# Altium schematic sheet DIOT_PSU_integrated.SchDoc: DI/OT Crate
size 420 x 297 mm; Project: DI/OT Backplane - Front panel PCB; CheckedBy: G. Daniluk; Author: F. Świtakowski; CompanyName: Creotech Instruments SA; DrawnBy: F. Świtakowski; Organization: CERN; Address1: European Organization for Nuclear Research; Address2: CH-1211 Geneve 23 - Switzerland; DocumentNumber: 1; Revision: -; SheetNumber: 1; SheetTotal: 1; EDA_Number: EDA-04213-V3-0; Projet: DI/OT Crate; CreateDate: 1.10.2019; CheckedDate: 10.11.2019; Title2: Front Interface; DivGrp: BE-CEM; Designer: F. Świtakowski; SPICEModelCacheTQWPXFHW: <root> / <DocumentId>TQWPXFHW</DocumentId> / </root>; DocumentName: AFPGA_power.SchDoc; ModifiedDate: -; Rule: PcbType=ProtelPcb
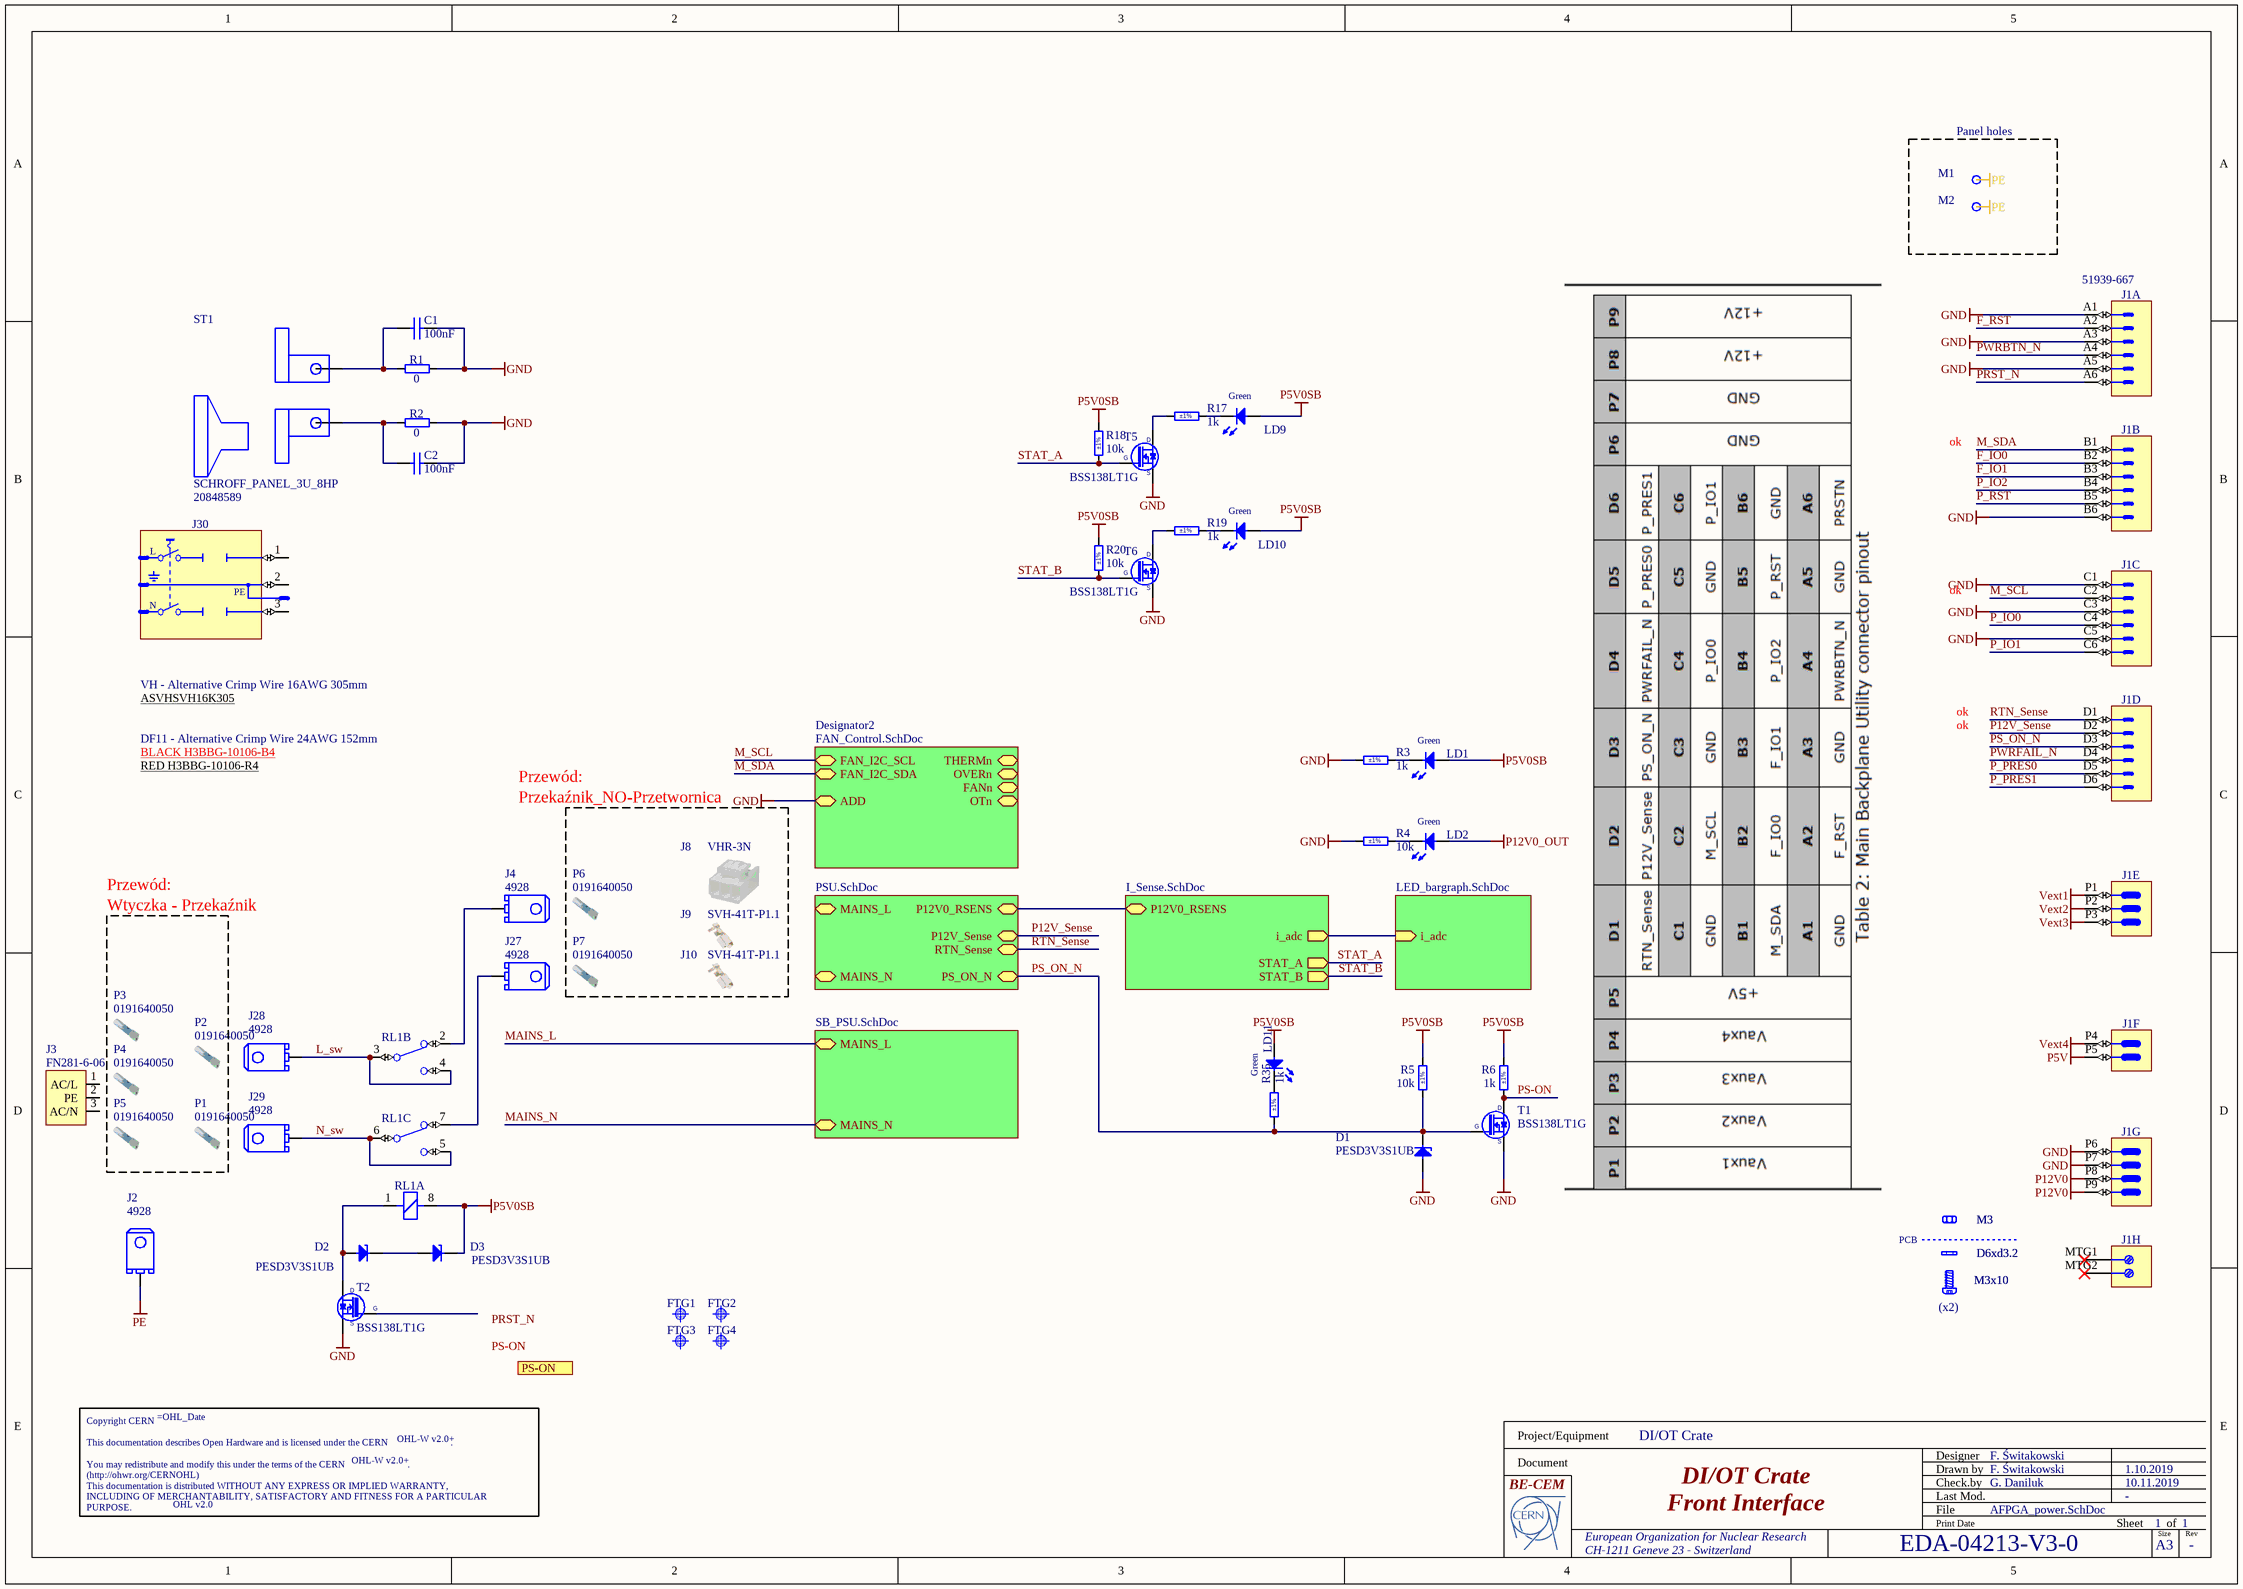
[diagram p0: DIOT_PSU_integrated.SchDoc]

## Parts
C1  100nF  [CAPC1608X87N]
C2  100nF  [CAPC1608X87N]
D1  PESD3V3S1UB  [SODFL1608X65N]
D2  PESD3V3S1UB  [SODFL1608X65N]
D3  PESD3V3S1UB  [SODFL1608X65N]
FTG1  Use only in PCB  [FIDUCIAL_TOP_C100-200]  (value not drawn)
FTG2  Use only in PCB  [FIDUCIAL_TOP_S100-200]  (value not drawn)
FTG3  Use only in PCB  [FIDUCIAL_TOP_C100-200]  (value not drawn)
FTG4  Use only in PCB  [FIDUCIAL_TOP_S100-200]  (value not drawn)
J1  Manufacturer Part Number: 51939-667  [AMPHENOL_51939-667]  (hidden comment: PwrBlade)  (parts A,B,C,D,E,F,G,H of 8)
J2  4928  [KEYSTONE_4928]
J3  FN281-6-06  [FN9264-2-06]
J4  4928  [KEYSTONE_4928]
J8  VHR-3N  [VHR-3N]
J9  SVH-41T-P1.1  [SVH-41T-P1.1]
J10  SVH-41T-P1.1  [SVH-41T-P1.1]
J27  4928  [KEYSTONE_4928]
J28  4928  [KEYSTONE_4928]
J29  4928  [KEYSTONE_4928]
J30  IEC  [SCHURTER_DD21.0121.1111]  (value not drawn)
LD1  Green  [LED_AVAGO_HSME-C120]
LD2  Green  [LED_AVAGO_HSME-C120]
LD9  Green  [LED_AVAGO_HSME-C120]
LD10  Green  [LED_AVAGO_HSME-C120]
LD11  Green  [LED_AVAGO_HSME-C120]
M1  Plated Hole  [MTG300_600]  (value not drawn)  (no BOM)
M2  Plated Hole  [MTG300_600]  (value not drawn)  (no BOM)
NUT1  M3  [BOSSARD_BN628-1241443_v]
NUT2  M3  [BOSSARD_BN628-1241443_v]
OHL1  CERN_OHL  [CERN_OHL]  (value not drawn)  (no BOM)
P1  0191640050  [0191640050]
P2  0191640050  [0191640050]
P3  0191640050  [0191640050]
P4  0191640050  [0191640050]
P5  0191640050  [0191640050]
P6  0191640050  [0191640050]
P7  0191640050  [0191640050]
R1  0  [RESC1608X55N]
R2  0  [RESC1608X55N]
R3  1k  Tolerance: ±1%  [RESC1608X55N]
R4  10k  Tolerance: ±1%  [RESC1608X55N]
R5  10k  Tolerance: ±1%  [RESC1608X55N]
R6  1k  Tolerance: ±1%  [RESC1608X55N]
R17  1k  Tolerance: ±1%  [RESC1608X55N]
R18  10k  Tolerance: ±1%  [RESC1608X55N]
R19  1k  Tolerance: ±1%  [RESC1608X55N]
R20  10k  Tolerance: ±1%  [RESC1608X55N]
R35  1k  Tolerance: ±1%  [RESC1608X55N]
RL1  REL_OMRON_G2RL-24  [REL_OMRON_G2RL-24]  (value not drawn)  (parts A,B,C of 3)
SCREW1  M3x10  [BOSSARD_BN5687-3061608_v]
SCREW2  M3x10  [BOSSARD_BN5687-3061608_v]
ST1  SCHROFF_PANEL_3U_8HP  Manufacturer Part Number 2: 20848589  [SCHROFF_PANEL_3HP_8U_CPCIS_AC_PSU]
T1  BSS138LT1G  [SOT95P240X110-3N]
T2  BSS138LT1G  [SOT95P240X110-3N]
T5  BSS138LT1G  [SOT95P240X110-3N]
T6  BSS138LT1G  [SOT95P240X110-3N]
WASHER1  D6xd3.2  [BOSSARD_BN83728-8243964_v]
WASHER2  D6xd3.2  [BOSSARD_BN83728-8243964_v]

## Blocks framed on the sheet
Panel holes: M1 M2
Wtyczka - Przekaźnik: P1-P5

## Sub-sheets
Designator1 = LED_bargraph.SchDoc: i_adc (in)
Designator2 = FAN_Control.SchDoc: ADD (bidir), THERMn (bidir), OVERn (bidir), FANn (bidir), FAN_I2C_SCL (bidir), FAN_I2C_SDA (bidir), OTn (bidir)
Designator3 = I_Sense.SchDoc: i_adc (out), STAT_A (out), STAT_B (out), P12V0_RSENS (bidir)
Designator4 = PSU.SchDoc: P12V_Sense (bidir), RTN_Sense (bidir), PS_ON_N (bidir), MAINS_L (bidir), MAINS_N (bidir), P12V0_RSENS (bidir)
Designator5 = SB_PSU.SchDoc: MAINS_L (bidir), MAINS_N (bidir)

## Ports
PS-ON (in)

## Nets
GND: C1.1 C2.1 D1.2(A) J1.A1 J1.A3 J1.A5 J1.B6 J1.C1 J1.C3 J1.C5 J1.P6 J1.P7 R1.2 R2.2 R3.1 R4.1 T1.2(S) T2.2(S) T5.2(S) T6.2(S) ; sheet Designator2/ADD
P5V: J1.P5
P5V0SB: D3.1(C) LD1.2(A) LD9.2(A) LD10.2(A) LD11.2(A) R5.2 R6.2 R18.2 R20.2 RL1.8
P12V0: J1.P8 J1.P9
P12V0_OUT: LD2.2(A)
PE: J2.1 M1.1 M2.1
Vext1: J1.P1
Vext2: J1.P2
Vext3: J1.P3
Vext4: J1.P4
F_IO0: J1.B2
F_IO1: J1.B3
F_RST: J1.A2
L_sw: J28.1 RL1.3(C) RL1.4(NO)
M_SCL: J1.C2 ; sheet Designator2/FAN_I2C_SCL
M_SDA: J1.B1 ; sheet Designator2/FAN_I2C_SDA
MAINS_L: sheet Designator5/MAINS_L
MAINS_N: sheet Designator5/MAINS_N
N_sw: J29.1 RL1.5(NO) RL1.6(C)
P12V_Sense: J1.D2 ; sheet Designator4/P12V_Sense
P_IO0: J1.C4
P_IO1: J1.C6
P_IO2: J1.B4
P_PRES0: J1.D5
P_PRES1: J1.D6
P_RST: J1.B5
PRST_N: J1.A6
PS-ON: R6.1 T1.3(D)
PS_ON_N: D1.1(C) J1.D3 R5.1 R35.1 T1.1(G) ; sheet Designator4/PS_ON_N
PWRBTN_N: J1.A4
PWRFAIL_N: J1.D4
RTN_Sense: J1.D1 ; sheet Designator4/RTN_Sense
STAT_A: R18.1 T5.1(G) ; sheet Designator3/STAT_A
STAT_B: R20.1 T6.1(G) ; sheet Designator3/STAT_B
NetC1_2: C1.2 R1.1 ST1.MH1
NetC2_2: C2.2 R2.1 ST1.MH2
NetD2_1: D2.1(C) D3.2(A)
NetD2_2: D2.2(A) RL1.1 T2.3(D)
NetJ4_1: J4.1 RL1.2(NC)
NetJ27_1: J27.1 RL1.7(NC)
NetLD1_1: LD1.1(C) R3.2
NetLD2_1: LD2.1(C) R4.2
NetLD9_1: LD9.1(C) R17.2
NetLD10_1: LD10.1(C) R19.2
NetLD11_1: LD11.1(C) R35.2
NetR17_1: R17.1 T5.3(D)
NetR19_1: R19.1 T6.3(D)
(unnamed): sheet Designator1/i_adc, sheet Designator3/i_adc
(unnamed): sheet Designator3/P12V0_RSENS, sheet Designator4/P12V0_RSENS

Not connected (* = marked no-connect by the designer): J1 MTG1* MTG2*; J3 1(AC/L) 2(PE) 3(AC/N); J30 1 2 3; T2 1(G)

## Notes on the sheet
- ok
- ASVHSVH16K305 <https://www.digikey.pl/en/products/detail/jst-sales-america-inc/ASVHSVH16K305/6009483>
- VH - Alternative Crimp Wire 16AWG 305mm
- DF11 - Alternative Crimp Wire 24AWG 152mm
- BLACK H3BBG-10106-B4 <https://www.digikey.pl/en/products/detail/jst-sales-america-inc/ASVHSVH16K203/9924197>
- RED H3BBG-10106-R4 <https://www.digikey.pl/en/products/detail/hirose-electric-co-ltd/H3BBG-10106-R4/312538?s=N4IgTCBcDaIBIGYBCSDiBaAjABhwNnQCUAWEAXQF8g>
- Przewód:
- (near J8) Przekaźnik_NO-Przetwornica
- PCB
- (x2)
- Labels drawn without touching a wire or pin: PRST_N, PS-ON
- Project/Equipment
- Document
- Designer
- Drawn by
- Check.by
- File
- Last Mod.
- Print Date
- Sheet
- Size
- A3
- of
- Rev
- (in symbol CERN_OHL) Copyright CERN / This documentation describes Open Hardware and is licensed under the CERN                         . / You may redistribute and modify this under the terms of the CERN                         . / (http://ohwr.org/CERNOHL) / This documentation is distributed WITHOUT ANY EXPRESS OR IMPLIED WARRANTY, / INCLUDING OF MERCHANTABILITY, SATISFACTORY AND FITNESS FOR A PARTICULAR PURPOSE. / Please see the CERN                   for applicable conditions.
- (in symbol SCHURTER_DD21.0121.1111) L; PE; N

## Library data of the parts
C1 C2 = CC0603_100NF_50V_10%_X5R: Non-polarised capacitor; Part Description: SMD Multilayer Chip Ceramic Capacitor; Manufacturer: GENERIC; Manufacturer1 Part Number: C1608X5R1H104K080; Voltage: 50V; TC: X5R; Tolerance: ±10%; Part Number: CC0603_100NF_50V_10%_X5R; Component Kind: Standard; Component Type: Standard; Pin Count: 2; Value: 100nF; Status: None; Manufacturer Part Number: CC0603_100NF_50V_10%_X5R; Case: 0603; Mounted: Yes; Socket: No; SMD: Yes; Sense: No; Manufacturer1 Example: TDK; Manufacturer1 ComponentHeight: 0.9mm; HelpURL: \\cern.ch\dfs\Applications\Altium\Datasheets\CC0603_X5R_TDK_C.pdf; Author: CERN DEM MR; CreateDate: 08.01.2016; LatestRevisionDate: 08.01.2016
D1-D3 = PESD3V3S1UB: ESD protection diode; Part Description: ESD protection diode (23kV); Manufacturer: NXP SEMICONDUCTORS; Voltage: 3V3; Power: 330W; PressFit: No; Bonding: No; Part Number: PESD3V3S1UB; Component Kind: Standard; Component Type: Standard; Device: PESD3V3S1UB; PackageDescription: Ultra Small Outline Diode Flat Lead (SOD-523), Body; 1.2mm L X 0.8mm W X 0.65mm H, IPC Medium Density; Manufacturer Part Number: PESD3V3S1UB; Pin Count: 2; Case: SOD523; Mounted: Yes; Socket: No; SMD: Yes; Sense: No; ComponentHeight: 0.65mm; HelpURL: \\cern.ch\dfs\Applications\Altium\Datasheets\PESD3V3S1UB.pdf; Author: CERN DEM JLC; CreateDate: 29.11.2012; LatestRevisionDate: 29.11.2012
FTG1 FTG3 = FIDUCIAL_TARGET_C100-200: Fiducial Target; Part Description: Round Fiducial Target, Top Layer, 1.0mm, Top Solder 2.0mm, Keepout =2.0mm; Mounted: No; Part Number: FIDUCIAL_TARGET_C100-200; Component Kind: Standard (No BOM); Component Type: Standard (No BOM); Pin Count: 1; Family: Fiducial; Socket: No; SMD: Yes; Sense: No; Status: None; ComponentHeight: 0mm; HelpURL: Undefined; Author: CERN DEM JLC; CreateDate: 09.02.2010; LatestRevisionDate: 04.04.2012; PackageDescription: Round Fiducial Target, Top Layer, 1.0mm, Top Solder 2.0mm, Keepout =2.0mm
FTG2 FTG4 = FIDUCIAL_TARGET_S100-200: Fiducial Target; Part Description: Square Fiducial Target, Top Layer, 1.0mm, Top Solder 2.0mm, Keepout =2.0mm; Mounted: No; Part Number: FIDUCIAL_TARGET_S100-200; Component Kind: Standard (No BOM); Component Type: Standard (No BOM); Pin Count: 1; Family: Fiducial; Socket: No; SMD: Yes; Sense: No; Status: None; ComponentHeight: 0mm; HelpURL: Undefined; Author: CERN DEM JLC; CreateDate: 09.02.2010; LatestRevisionDate: 04.04.2012; PackageDescription: Square Fiducial Target, Top Layer, 1.0mm, Top Solder 2.0mm, Keepout =2.0mm
J1 = AMPHENOL_51939-667: Thru-Hole, Lead 3.43mm, PowerBlade Right Angled Power Connector 3ACP 2P 24S 4P Contacts; Part Description: Right Angle PowerBlade Power Connector 3ACP + 2P + 24S + 4P Contacts; PressFit: No; Part Number: AMPHENOL_51939-667; Component Kind: Standard; Component Type: Standard; Pin Count: 33; Family: PwrBlade; Mounted: Yes; Socket: No; SMD: No; Sense: No; Status: None; Manufacturer: AMPHENOL; ComponentHeight: 12.57mm; HelpURL: \\cern.ch\dfs\Applications\Altium\Datasheets\AMPHENOL_51939-667.pdf; Author: CERN DEM JLC; CreateDate: 05.03.2019; LatestRevisionDate: 05.03.2019
J2 J4 J27-J29 = KEYSTONE_4928: 0.240" (6.10mm) Quick Connect Male Solder Connector Non-Insulated; PressFit: No; Part Number: 4928; Component Kind: Standard; Component Type: Standard; Pin Count: 4; Mounted: Yes; Socket: No; SMD: No; Sense: No; Status: None; Part Description: 0.240" (6.10mm) Quick Connect Male Solder Connector Non-Insulated; Manufacturer: KEYSTONE; Manufacturer Part Number: 4928; ComponentHeight: 10.49mm; HelpURL: https://www.keyelco.com/product-pdf.cfm?p=14309; Author: LPA; CreateDate: 18.02.2025; LatestRevisionDate: 18.02.2025; ComponentLink1Description: Datasheet; ComponentLink1URL: https://www.keyelco.com/product-pdf.cfm?p=14309
J3 = FN281-6-06: Power Entry Connector Receptacle, Male Blades - Module IEC 320-C14 Panel Mount, Flange; Manufacturer: Schaffner EMC Inc.; PressFit: No; Part Number: FN281-6-06; Footprint: FN281-6-06; Pin Count: 3; Mounted: Yes; Socket: No; SMD: No; Sense: No; Status: None; Part Description: Power Entry Connector Receptacle, Male Blades - Module IEC 320-C14 Panel Mount, Flange; Manufacturer Part Number: FN281-6-06; ComponentHeight: 35; HelpURL: https://www.schaffner.com/product/FN280/Schaffner_datasheet_FN280.pdf; Author: LPA; CreateDate: 08.02.2025; LatestRevisionDate: 08.02.2025; ComponentLink1Description: Datasheet; ComponentLink1URL: https://www.digikey.pl/pl/products/detail/schaffner-emc-inc/FN281-6-06/1997105?srsltid=AfmBOopo_2hCIzMtiGmdja5qUgne8hiecT0bkO3ZLGT1zD_KD1Bja1J0
J8 = VHR-3N: 3 Rectangular Connectors - Housings Receptacle Natural 0.156" (3.96mm); Manufacturer: JST Sales America Inc.; PressFit: No; Part Number: VHR-3N; Component Kind: Standard; Component Type: Standard; Pin Count: 1; Family: VH; Mounted: Yes; Socket: No; SMD: No; Sense: No; Status: None; Part Description: 3 Rectangular Connectors - Housings Receptacle Natural 0.156" (3.96mm); Manufacturer Part Number: VHR-3N; HelpURL: https://www.jst-mfg.com/product/pdf/eng/eVH.pdf; Author: LPA; CreateDate: 09.02.2025; LatestRevisionDate: 09.02.2025
J9 J10 = SVH-41T-P1.1: Socket Contact Tin 16-20 AWG Crimp; Manufacturer: JST Sales America Inc.; PressFit: No; Part Number: SVH-41T-P1.1; Component Kind: Socket Contact; Component Type: Socket Contact; Pin Count: 1; Family: vh; Mounted: Yes; Socket: No; SMD: No; Sense: No; Status: None; Part Description: Socket Contact Tin 16-20 AWG Crimp; Manufacturer Part Number: SVH-41T-P1.1; ComponentHeight: N/A; HelpURL: https://www.jst-mfg.com/product/pdf/eng/eVH.pdf; Author: LPA; CreateDate: 09.02.2025; LatestRevisionDate: 09.02.2025
J30 = SCHURTER_DD21.0121.1111: Connector 3 Male 2P+ 2 Fuse Holder + Line Switch 2 Poles; Part Description: 10A 250Vac IEC Appliance Inlet C14 with Line Switch 2-Pole, Fuseholder 2-Pole for Fuse Links 5x20mm; PressFit: No; Part Number: SCHURTER_DD21.0121.1111; Component Kind: Standard; Component Type: Standard; Pin Count: 3; Family: IEC; Mounted: Yes; Socket: No; SMD: No; Sense: No; Status: None; Manufacturer: SCHURTER; Manufacturer Part Number: DD21.0121.1111; ComponentHeight: 32.3mm; HelpURL: \\cern.ch\dfs\Applications\Altium\Datasheets\SCHURTER_DD21.0121.1111.pdf; Author: CERN DEM JLC; CreateDate: 19.11.2012; LatestRevisionDate: 19.11.2012
LD1 LD2 LD9-LD11 = LED_AVAGO_HSME-C120: LED Green 1C 2A; Part Description: High Performance Right Angle Chip Green LED; Manufacturer: AVAGO TECHNOLOGIES; PressFit: No; Bonding: No; Part Number: LED_AVAGO_HSME-C120; Component Kind: Standard; Component Type: Standard; Color: Green; PackageDescription: Green Chip LED, 2-Leads, Body 1.7x1.1mm, Side Emitting Package; Manufacturer Part Number: HSME-C120; Pin Count: 2; Mounted: Yes; Socket: No; SMD: Yes; Sense: No; ComponentHeight: 0.7mm; HelpURL: \\cern.ch\dfs\Applications\Altium\Datasheets\LED_AVAGO_HSME-C120.pdf; ComponentLink1URL: \\cern.ch\dfs\Applications\Altium\Datasheets\LED_AVAGO_HSME-C110_DESIGN-GUIDE.pdf; ComponentLink1Description: Design Guide; Author: CERN DEM JMW; CreateDate: 22.07.2009; LatestRevisionDate: 20.06.2012
M1 M2 = PLATED_HOLE3.0_PAD6.0: Single Terminal Socket; Part Description: Plated Through Hole: Hole Dia.=3.0mm Pad Dia.=6.0mm; Mounted: No; Part Number: PLATED_HOLE3.0_PAD6.0; Component Type: Standard (No BOM); Pin Count: 1; Family: Plated Hole; Socket: No; SMD: No; Status: None; ComponentHeight: 0mm; Author: CERN DEM JLC; CreateDate: 26.05.2008; LatestRevisionDate: 26.05.2008; PackageDescription: Plated Through Hole: Hole Dia.=3.0mm Pad Dia.=6.0mm; Sense: No; HelpURL: Undefined
NUT1 NUT2 = BOSSARD_BN628-1241443_v: Nut; Part Description: M3 Hexagon Nut ~0,8d, ISO 4032, DIN 934, Stainless Steel A2; Manufacturer Part Number: BN628 Art.1241443; PressFit: No; Part Number: BOSSARD_BN628-1241443_v; Component Kind: Standard; Component Type: Mechanical; Pin Count: 0; PackageDescription: M3 Hexagon Nut ~0,8d, ISO 4032, DIN 934, Stainless Steel A2; Mounted: Yes; Socket: No; SMD: No; Sense: No; Status: None; Value: M3; Manufacturer: BOSSARD; ComponentHeight: 2.4mm; HelpURL: \\cern.ch\dfs\Applications\Altium\Datasheets\BOSSARD_BN628-1241443.pdf; Author: CERN DEM JMW; CreateDate: 04.12.2015; LatestRevisionDate: 04.12.2015
OHL1 = CERN_OHL: Part Description: Copyright CERN; OHL_License: OHL-W v2.0+; OHL_Version: OHL v2.0; Mounted: No; OHL_Date: =Year; Part Number: CERN_OHL; Component Type: Standard (No BOM); Pin Count: 0; Socket: No; SMD: No; Sense: No; Status: None; ComponentHeight: 0mm; HelpURL: Undefined; Author: CERN DEM HF; CreateDate: 03.12.2021; LatestRevisionDate: 03.12.2021; PackageDescription: Texte Copyright Cern
P1-P7 = 0191640050: 0.250" (6.35mm) Quick Connect Female 14-16 AWG Crimp Connector Fully Insulated Heat Shrink; Manufacturer: Molex; PressFit: No; Part Number: 0191640050; Component Kind: Socket Contact; Component Type: Socket Contact; Pin Count: 1; Family: Perma-Seal; Mounted: Yes; Socket: No; SMD: No; Sense: No; Status: None; Part Description: 0.250" (6.35mm) Quick Connect Female 14-16 AWG Crimp Connector Fully Insulated Heat Shrink; Manufacturer Part Number: 0191640050; ComponentHeight: N/A; HelpURL: https://www.molex.com/en-us/products/part-detail/191640050?display=pdf; Author: LPA; CreateDate: 18.02.2025; LatestRevisionDate: 18.02.2025; ComponentLink1Description: Datasheet; ComponentLink1URL: https://www.molex.com/en-us/products/part-detail/191640050?display=pdf
R1 R2 = R0603_0R_JUMPER: Resistor; Part Description: 1A (0.05R Max DC Resistance) Zero Ohm Jumper; Manufacturer: GENERIC; Manufacturer1 Part Number: NRC06Z0; PressFit: No; Part Number: R0603_0R_JUMPER; Component Kind: Standard; Component Type: Standard; Pin Count: 2; Value: 0; Status: Preferred; Manufacturer Part Number: R0603_0R_JUMPER; Case: 0603; Mounted: Yes; Sense: No; Socket: No; SMD: Yes; Manufacturer1 Example: NIC COMPONENT; Manufacturer1 ComponentHeight: 0.55mm; HelpURL: \\cern.ch\dfs\Applications\Altium\Datasheets\R0603_NIC_NRC.pdf; Author: CERN DEM JLC; CreateDate: 03.12.2007; LatestRevisionDate: 13.03.2008
R3 R6 R17 R19 R35 = R0603_1K_1%_0.1W_100PPM: Resistor - 1%; Part Description: General Purpose Thick Film Chip Resistor; Manufacturer: GENERIC; Manufacturer1 Part Number: NRC06F1001TRF; Power: 0.1W; TC: ±100ppm/°C; PressFit: No; Part Number: R0603_1K_1%_0.1W_100PPM; Component Kind: Standard; Component Type: Standard; Pin Count: 2; Value: 1k; Status: Preferred; Manufacturer Part Number: R0603_1K_1%_0.1W_100PPM; Case: 0603; Mounted: Yes; Sense: No; Socket: No; SMD: Yes; Manufacturer1 Example: NIC COMPONENT; Manufacturer1 ComponentHeight: 0.55mm; HelpURL: \\cern.ch\dfs\Applications\Altium\Datasheets\R0603_NIC_NRC.pdf; Author: CERN DEM JLC; CreateDate: 03.12.2007; LatestRevisionDate: 13.03.2008
R4 R5 R18 R20 = R0603_10K_1%_0.1W_100PPM: Resistor - 1%; Part Description: General Purpose Thick Film Chip Resistor; Manufacturer: GENERIC; Manufacturer1 Part Number: NRC06F1002TRF; Power: 0.1W; TC: ±100ppm/°C; PressFit: No; Part Number: R0603_10K_1%_0.1W_100PPM; Component Kind: Standard; Component Type: Standard; Pin Count: 2; Value: 10k; Status: Preferred; Manufacturer Part Number: R0603_10K_1%_0.1W_100PPM; Case: 0603; Mounted: Yes; Sense: No; Socket: No; SMD: Yes; Manufacturer1 Example: NIC COMPONENT; Manufacturer1 ComponentHeight: 0.55mm; HelpURL: \\cern.ch\dfs\Applications\Altium\Datasheets\R0603_NIC_NRC.pdf; Author: CERN DEM JLC; CreateDate: 03.12.2007; LatestRevisionDate: 13.03.2008
RL1 = REL_OMRON_G2RL-24-DC5: DPDT Power Relay, G2RL Series; Part Description: 8A@250VAC, DPDT Power Relay, G2RL Series; Manufacturer: OMRON ELECTRONIC; PressFit: No; Sense Comment: Sensitive=No (Component Sealed); Value: 5VDC; Part Number: REL_OMRON_G2RL-24-DC5; Component Kind: Standard; Component Type: Standard; Pin Count: 8; PackageDescription: 8 Leads, Row Spacing 7.5mm; Body 29mm x 12.7mm, OMRON_G2RL Series; Mounted: Yes; Socket: No; SMD: No; Sense: No; Status: None; Manufacturer Part Number: G2RL-24-DC5; ComponentHeight: 15.7mm; HelpURL: \\cern.ch\dfs\Applications\Altium\Datasheets\REL_OMRON_G2RL-24.pdf; Author: CERN DEM BC; CreateDate: 11.09.2023; LatestRevisionDate: 11.09.2023
SCREW1 SCREW2 = BOSSARD_BN5687-3061608_v: Screw; Part Description: M3 L=10mm Hexalobular Socket Pan Head Screw, Fully Threaded, Stainless Steel A2; Manufacturer Part Number: BN5687 Art.3061608; PressFit: No; Part Number: BOSSARD_BN5687-3061608_v; Component Kind: Standard; Component Type: Mechanical; Pin Count: 0; PackageDescription: M3 L=10mm Hexalobular Socket Pan Head Screw, Fully Threaded - Stainless Steel A2; Mounted: Yes; Socket: No; SMD: No; Sense: No; Status: None; Value: M3x10; Manufacturer: BOSSARD; ComponentHeight: 12.4mm; HelpURL: \\cern.ch\dfs\Applications\Altium\Datasheets\BOSSARD_BN5687-3061608.pdf; Author: CERN DEM JLC; CreateDate: 22.08.2013; LatestRevisionDate: 22.08.2013
ST1 = SCHROFF_PANEL_3U_8HP_CPCIS_PSU: Schroff 8HP 4U EUROCARD Panel with ejector; Manufacturer: Schroff; Manufacturer Part Number: 20848589
T1 T2 = BSS138LT1G: N-CHANNEL MOSFET WITH DIODE; Part Description: 50V, 200mA N-Channel Enhancement Mode Field-Effect Transistor; Manufacturer: ON SEMICONDUCTOR; PressFit: No; Bonding: No; Part Number: BSS138LT1G; Component Kind: Standard; Component Type: Standard; Device: BSS138LT1G; PackageDescription: SOT23, 0.95mm Pitch; 3 Pin, 1.40mm W X 3.00mm L X 1.10mm H body, IPC Medium Density; Manufacturer Part Number: BSS138L; Pin Count: 3; Case: SOT23-3; Mounted: Yes; Socket: No; SMD: Yes; Sense: No; ComponentHeight: 1.11mm; HelpURL: \\cern.ch\dfs\Applications\Altium\Datasheets\BSS138LT1G.pdf; Author: CERN DEM JLC; CreateDate: 23.03.2009; LatestRevisionDate: 25.05.2022
T5 T6 = BSS138LT1G: N-CHANNEL MOSFET WITH DIODE; Part Description: 50V 200mA N-Channel Enhancement Mode Field-Effect Transistor; Manufacturer: ON SEMICONDUCTOR; PressFit: No; Bonding: No; Part Number: BSS138LT1G; Component Kind: Standard; Component Type: Standard; Device: BSS138LT1G; PackageDescription: SOT23 3-Leads, Pitch 0.95mm - Body 1.4x3mm, IPC Medium Density; Manufacturer Part Number: BSS138LT1G; Pin Count: 3; Case: SOT23-3; Mounted: Yes; Socket: No; SMD: Yes; Sense: No; ComponentHeight: 1.11mm; HelpURL: \\cern.ch\dfs\Applications\Altium\Datasheets\BSS138LT1G.pdf; Author: CERN DEM JLC; CreateDate: 23.03.2009; LatestRevisionDate: 23.03.2009
WASHER1 WASHER2 = BOSSARD_BN83728-8243964_v: Washer; Part Description: Waved Spring Washer for M3 Screw - Steel 440-520 HV - Zinc Plated Blue; Manufacturer Part Number: BN83728 Art.8243964; PressFit: No; Part Number: BOSSARD_BN83728-8243964_v; Component Kind: Standard; Component Type: Mechanical; Pin Count: 0; PackageDescription: Waved Spring Washer for M3 Screw, Steel 440-520 HV, Zinc Plated Blue; Mounted: Yes; Socket: No; SMD: No; Sense: No; Status: None; Value: D6xd3.2; Manufacturer: BOSSARD; ComponentHeight: 0.4mm; HelpURL: \\cern.ch\dfs\Applications\Altium\Datasheets\BOSSARD_BN83728-8243964.pdf; Author: CERN DEM JLC; CreateDate: 27.04.2017; LatestRevisionDate: 27.04.2017